# EAGLE design ProjectFile (EAGLE 9.2.2)
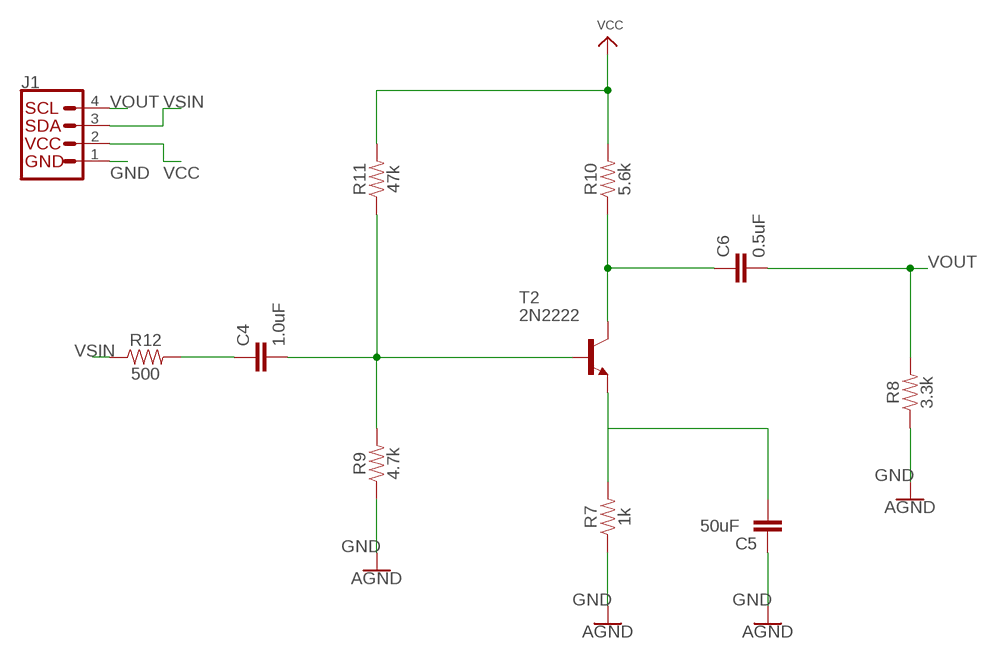
[diagram p0: schematic, sheet 1]

## Parts
C4  1.0uF  1.0UF-0603-16V-10%  [0603]
C5  50uF  1.0UF-0603-16V-10%  [0603]
C6  0.5uF  1.0UF-0603-16V-10%  [0603]
J1  QWIIC_CONNECTORJS-1MM  [1X04_1MM_RA]
R7  1k  1KOHM-0603-1/10W-1%  [0603]
R8  3.3k  3.3KOHM-0603-1/10W-1%  [0603]
R9  4.7k  4.7KOHM-0603-1/10W-1%  [0603]
R10  5.6k  5.6KOHM-0603-1/10W-1%  [0603]
R11  47k  47KOHM-0603-1/10W-1%  [0603]
R12  500  300OHM-0603-1/10W-1%  [0603]
T2  2N2222  [TO92-EBC-OVAL]

## Nets
GND: C5.1 J1.1(GND) R7.1 R8.1 R9.1 ; supply symbol labelled AGND
N$2: C6.1 R10.1 T2.C
N$5: C5.2 R7.2 T2.E
N$7: C4.2 R9.2 R11.1 T2.B
N$8: C4.1 R12.2
VCC: J1.2(VCC) R10.2 R11.2
VOUT: C6.2 J1.4(SCL) R8.2
VSIN: J1.3(SDA) R12.1

## Library data of the parts
C4 = SparkFun-Capacitors:1.0UF: 1µF ceramic capacitors A capacitor is a passive two-terminal electrical component used to store electrical energy temporarily in an electric field.; PROD_ID: CAP-00868
C5 C6 = SparkFun-Capacitors:1.0UF: 1µF ceramic capacitors A capacitor is a passive two-terminal electrical component used to store electrical energy temporarily in an electric field.; PROD_ID: CAP-00868; VALUE: 1.0uF
J1 = SparkFun-Connectors:QWIIC_CONNECTOR: SparkFun I2C Standard Qwiic Connector An SMD 1mm pitch JST connector makes it easy and quick (get it? Qwiic?) to connect I2C devices to each other. The Qwiic system <http://www.sparkfun.com/qwiic> enables fast and solderless connection between popular platforms and various sensors and actuators. We carry 200mm <https://www.sparkfun.com/products/14204>, 100mm <https://www.sparkfun.com/products/14205>, 50mm <https://www.sparkfun.com/products/14206>, and breadboard friendly <https://www.sparkfun.com/products/14207> Qwiic cables. We also offer 10 pcs strips <https://www.sparkfun.com/products/14323> the SMD connectors.
R7 = SparkFun-Resistors:1KOHM: 1kΩ resistor A resistor is a passive two-terminal electrical component that implements electrical resistance as a circuit element. Resistors act to reduce current flow, and, at the same time, act to lower voltage levels within circuits. - Wikipedia; PROD_ID: RES-07856
R8 = SparkFun-Resistors:3.3KOHM: 3.3kΩ resistor A resistor is a passive two-terminal electrical component that implements electrical resistance as a circuit element. Resistors act to reduce current flow, and, at the same time, act to lower voltage levels within circuits. - Wikipedia; PROD_ID: RES-07851
R9 = SparkFun-Resistors:4.7KOHM: 4.7kΩ resistor A resistor is a passive two-terminal electrical component that implements electrical resistance as a circuit element. Resistors act to reduce current flow, and, at the same time, act to lower voltage levels within circuits. - Wikipedia; PROD_ID: RES-07857
R10 = SparkFun-Resistors:5.6KOHM: 5.6kΩ resistor A resistor is a passive two-terminal electrical component that implements electrical resistance as a circuit element. Resistors act to reduce current flow, and, at the same time, act to lower voltage levels within circuits. - Wikipedia; PROD_ID: RES-12378
R11 = SparkFun-Resistors:47KOHM: 47kΩ resistor A resistor is a passive two-terminal electrical component that implements electrical resistance as a circuit element. Resistors act to reduce current flow, and, at the same time, act to lower voltage levels within circuits. - Wikipedia; PROD_ID: RES-07871
R12 = SparkFun-Resistors:300OHM: 300Ω resistor A resistor is a passive two-terminal electrical component that implements electrical resistance as a circuit element. Resistors act to reduce current flow, and, at the same time, act to lower voltage levels within circuits. - Wikipedia; PROD_ID: RES_10328; VALUE: 300
T2 = adafruit:2N2222: NPN TRANSISTOR Big oval pads

## Board
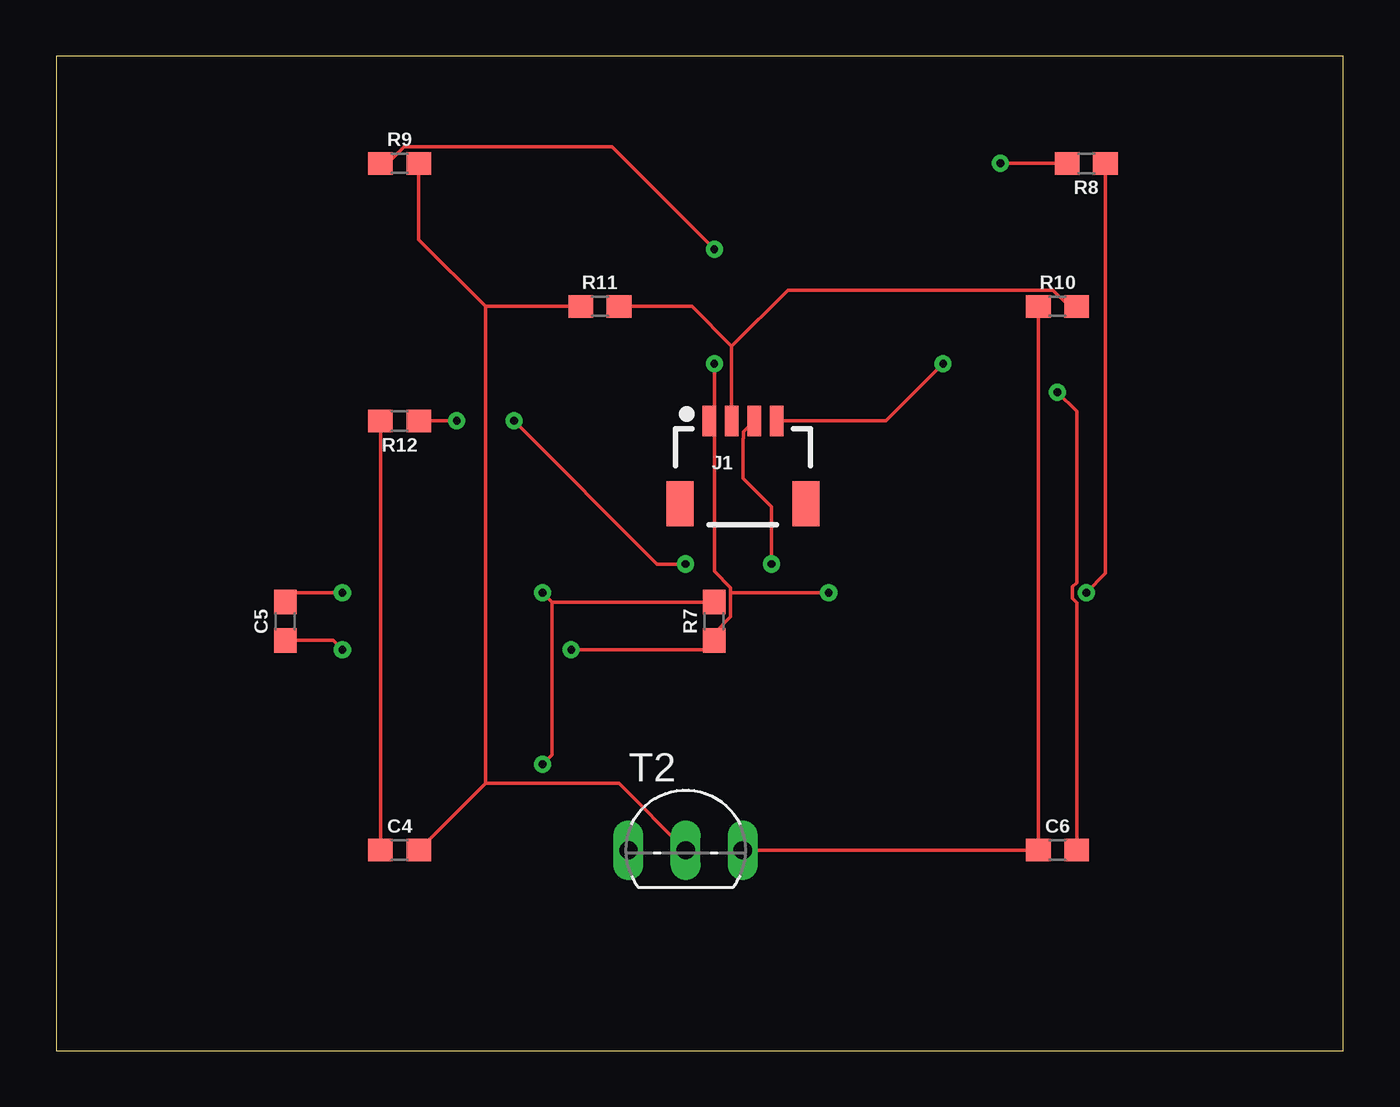
[diagram p1: board, top side]
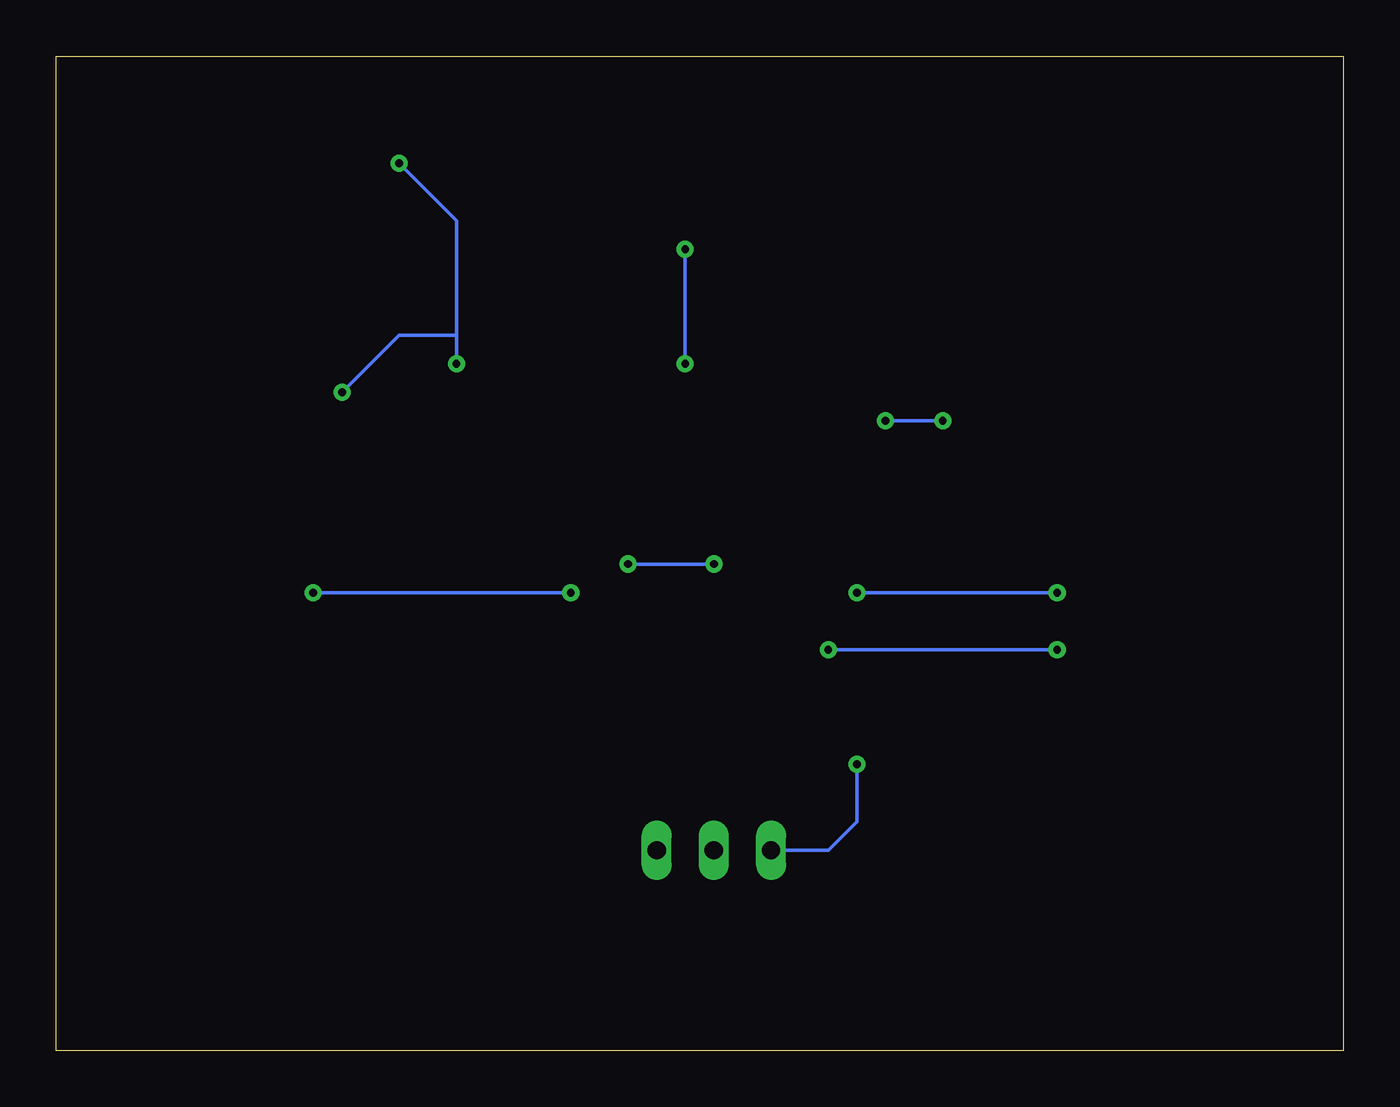
[diagram p2: board, bottom side, seen from below]

Size 57.13 x 44.12 mm. Coordinates in mm from the lower left corner, seen from the top.
Outline: 0,0 57.13,0 57.13,44.12 0,44.12 0,0
Copper layers (1*16): Top 0.035mm / dielectric 1.5mm / Bottom 0.035mm
Design rules "default": minimum track width 6mil, minimum drill 0.35mm, track to track 6mil, track to pad 6mil, pad to pad 6mil, via to via 6mil, smd to smd 6mil, copper to edge 40mil, drill to drill 6mil, minimum pad ring 10mil, minimum via ring 8mil, stop-mask expansion 4mil, vias tented up to drill 0mil, thermal gap 10mil

### Footprints (pad centres in the part's own frame; a part is rotated, then mirrored left to right if it is on the bottom)
0603 = smd 1.1 x 1: 1 -0.85,0; 2 0.85,0
1X04_1MM_RA = smd 0.6 x 1.35: 1 -1.5,0; 2 -0.5,0; 3 0.5,0; 4 1.5,0 | smd 1.2 x 2: NC1 2.8,-3.675; NC2 -2.8,-3.675
TO92-EBC-OVAL = drill 0.813 long: B 0,-1.27; C 2.54,-1.27; E -2.54,-1.27

### Placement (x,y rotation side)
C4  15.24,8.89 0 top
C5  10.16,19.05 90 top
C6  44.45,8.89 0 top
J1  30.48,27.94 0 top
R7  29.21,19.05 90 top
R8  45.72,39.37 180 top
R9  15.24,39.37 0 top
R10  44.45,33.02 0 top
R11  24.13,33.02 0 top
R12  15.24,27.94 180 top
T2  27.94,10.16 0 top

### Tracks (layer width: path | path; a pad name or v marks a point on that pad's centre or on a via)
GND  (via drill 0.35)
  Top 0.152: 29.94,20.32 29.94,19.25 29.21,18.53 R7.1 28.79,17.78 v22.86,17.78 | 29.94,20.32 29.94,20.55 29.21,21.27 29.21,27.71 J1.1 29.21,28.17 v29.21,30.48 | v12.7,17.78 12.28,18.2 C5.1 | R8.1 46.57,21.17 v45.72,20.32 | v34.29,20.32 29.94,20.32 | R9.1 14.72,39.37 15.45,40.1 24.67,40.1 v29.21,35.56
  Bottom 0.152: v22.86,17.78 v12.7,17.78 | v45.72,20.32 v34.29,20.32 | v29.21,35.56 v29.21,30.48
N$2
  Top 0.152: T2.C C6.1 R10.1
N$5  (via drill 0.35)
  Top 0.152: R7.2 22.01,19.9 | 22.01,19.9 v21.59,20.32 | v12.7,20.32 10.58,20.32 C5.2 | 22.01,19.9 22.01,13.12 v21.59,12.7
  Bottom 0.152: v21.59,20.32 v12.7,20.32 | v21.59,12.7 21.59,10.16 22.86,8.89 T2.E
N$7
  Top 0.152: R9.2 16.09,35.98 19.05,33.02 | 19.05,33.02 R11.1 | 19.05,33.02 19.05,11.85 | 19.05,11.85 C4.2 | 19.05,11.85 24.98,11.85 T2.B
N$8
  Top 0.152: R12.2 C4.1
VCC
  Top 0.152: R10.2 44.97,33.02 44.24,33.75 32.48,33.75 29.98,31.25 | 29.98,31.25 J1.2 | R11.2 28.21,33.02 29.98,31.25
VOUT  (via drill 0.35)
  Top 0.152: J1.4 36.83,27.94 v39.37,30.48 | v44.45,29.21 45.3,28.36 45.3,20.76 45.11,20.57 45.11,20.07 45.3,19.88 C6.2 | v41.91,39.37 R8.2
  Bottom 0.152: v39.37,30.48 39.37,31.75 | 39.37,31.75 39.37,36.83 v41.91,39.37 | 39.37,31.75 41.91,31.75 v44.45,29.21
VSIN  (via drill 0.35)
  Top 0.152: R12.1 v17.78,27.94 | v20.32,27.94 26.67,21.59 v27.94,21.59 | v31.75,21.59 31.75,24.13 30.48,25.4 30.48,27.14 30.51,27.17 30.51,27.47 J1.3
  Bottom 0.152: v17.78,27.94 v20.32,27.94 | v27.94,21.59 v31.75,21.59